# Altium project Clock_Led7_23.PrjPcb
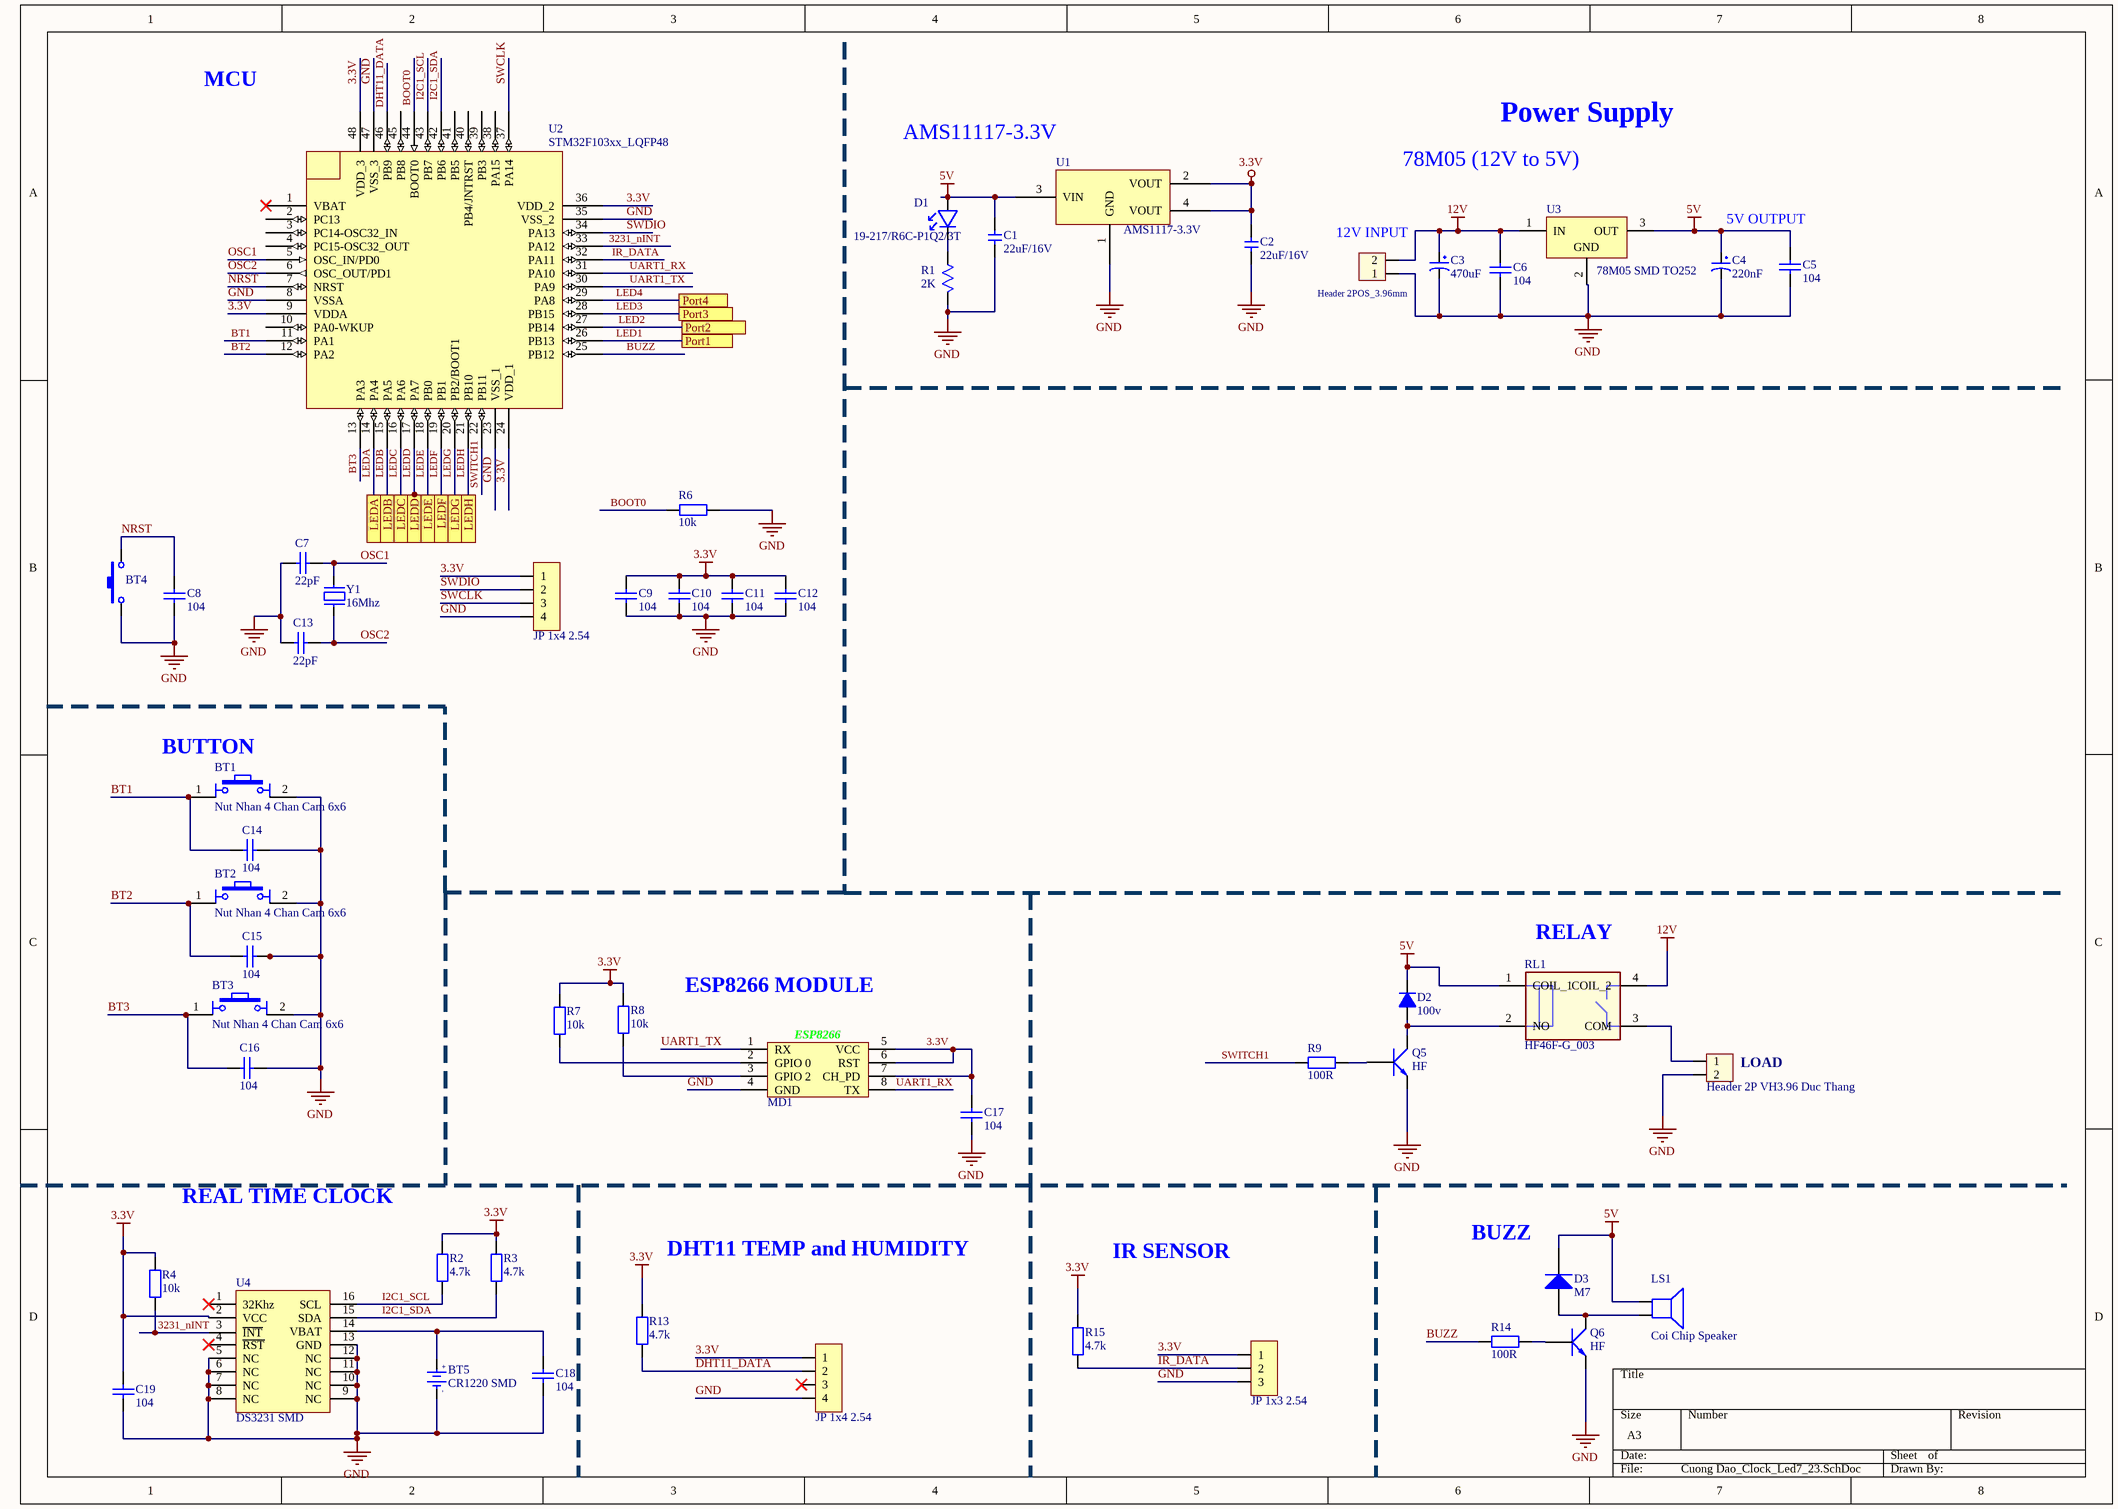
[diagram p0: Cuong Dao_Clock_Led7_23.SchDoc]
2 sheets, 65 parts. Net scope: flat (ports and power ports of the same name join across sheets).
Board file: Clock_Led7_23.PcbDoc
Sheets:
  Cuong Dao_Clock_Led7_23.SchDoc
  LED7seg.SchDoc

## Sheet Cuong Dao_Clock_Led7_23.SchDoc
size A3; SheetNumber: 1; SheetTotal: 2

### Parts
BT1  Nut Nhan 4 Chan Cam 6x6  [Nut Nhan 4 Chan Cam 6x6]
BT2  Nut Nhan 4 Chan Cam 6x6  [Nut Nhan 4 Chan Cam 6x6]
BT3  Nut Nhan 4 Chan Cam 6x6  [Nut Nhan 4 Chan Cam 6x6]
BT4  Nut Nhan 2 Chan SMD 3x6x2.5  [Nut Nhan 2 Chan SMD 3x6x2.5]  (value not drawn)
BT5  CR1220 SMD  [DE PIN CR1220]
C1  22uF/16V  [C0603]
C2  22uF/16V  [C0603]
C3  470uF  [tu hoa 10mm]
C4  220nF  [tu hoa 8mm]
C5  104  [tu 1206]
C6  104  [tu 1206]
C7  22pF  [tu 0805]
C8  104  [tu 0805]
C9  104  [tu 0805]
C10  104  [tu 0805]
C11  104  [tu 0805]
C12  104  [tu 0805]
C13  22pF  [tu 0805]
C14  104  [tu 0805]
C15  104  [tu 0805]
C16  104  [tu 0805]
C17  104  [tu 0805]
C18  104  [tu 0805]
C19  104  [tu 0805]
D1  19-217/R6C-P1Q2/3T  [LED_19-217]
D2  100v  [DIODE 0.5A]
D3  M7  [DIODE SMA]
H1  Header 2POS_3.96mm  [VH3.96M-2]
H2  Header 2P VH3.96 Duc Thang  [VH3.96M-2]
JP1  JP 1x4 2.54  [JP 1x4 DT]
JP2  JP 1x3 2.54  [JP 1x3 CT]
JP3  JP 1x4 2.54  [JP 1x4 CT]
LS1  Coi Chip Speaker  [Coi Chip Speacker]
MD1  ESP8266 Module  [ESP2866 Module]  (value not drawn)
Q5  HF  [SOT23]
Q6  HF  [SOT23]
R1  2K  [RES0603]
R2  4.7k  [tro smd 0805]
R3  4.7k  [tro smd 0805]
R4  10k  [tro smd 0805]
R6  10k  [tro smd 0805]
R7  10k  [tro smd 0805]
R8  10k  [tro smd 0805]
R9  100R  [tro smd 0805]
R13  4.7k  [tro smd 0805]
R14  100R  [tro smd 0805]
R15  4.7k  [tro smd 0805]
RL1  HF46F-G_003  [HF46F012HS1F610]
U1  AMS1117-3.3V  [SOT223]
U2  STM32F103xx_LQFP48  [STM32_LQPF48]
U3  78M05 SMD TO252  [TO252]
U4  DS3231 SMD  [SOIC 16]
Y1  16Mhz  [Thach Anh 2 chan SMD]

### Ports
LEDA, LEDB, LEDC, LEDD, LEDE, LEDF, LEDG, LEDH, Port1, Port2, Port3, Port4

### Nets
3.3V: C2.1 C9.1 C10.1 C11.1 C12.1 C17.2 C19.2 JP1.1 JP2.1 JP3.1 MD1.5(VCC) MD1.6(RST) MD1.7(CH_PD) R2.2 R3.2 R4.2 R7.1 R8.2 R13.2 R15.2 U1.2(VOUT) U1.4(VOUT) U2.9(VDDA) U2.24(VDD_1) U2.36(VDD_2) U2.48(VDD_3) U4.2(VCC)
5V: C1.1 C4.1 C5.1 D1.2(A) D2.2(K) D3.2(K) LS1.1 RL1.1(COIL_1) U1.3(VIN) U3.3(OUT)
12V: C3.1 C6.1 H1.2 RL1.4(COIL_2) U3.1(IN)
GND: BT1.2 BT2.2 BT3.2 BT4.1 BT5.2(GND) C1.2 C2.2 C3.2 C4.2 C5.2 C6.2 C7.2 C8.2 C9.2 C10.2 C11.2 C12.2 C13.1 C14.2 C15.2 C16.2 C17.1 C18.1 C19.1 H1.1 H2.2 JP1.4 JP2.3 JP3.4 MD1.4(GND) Q5.2(E) Q6.2(E) R1.2 R6.1 U1.1(GND) U2.8(VSSA) U2.23(VSS_1) U2.35(VSS_2) U2.47(VSS_3) U3.2(GND) U4.5(NC) U4.6(NC) U4.7(NC) U4.8(NC) U4.9(NC) U4.10(NC) U4.11(NC) U4.12(NC) U4.13(GND)
3231_nINT: R4.1 U2.33(PA12) U4.3(~{INT})
BOOT0: R6.2 U2.44(BOOT0)
BT1: BT1.1 C14.1 U2.11(PA1)
BT2: BT2.1 C15.1 U2.12(PA2)
BT3: BT3.1 C16.1 U2.13(PA3)
BUZZ: R14.1 U2.25(PB12)
DHT11_DATA: JP3.2 R13.1 U2.46(PB9)
I2C1_SCL: R2.1 U2.43(PB7) U4.16(SCL)
I2C1_SDA: R3.1 U2.42(PB6) U4.15(SDA)
IR_DATA: JP2.2 R15.1 U2.32(PA11)
LED1: U2.26(PB13) ; port Port1
LED2: U2.27(PB14) ; port Port2
LED3: U2.28(PB15) ; port Port3
LED4: U2.29(PA8) ; port Port4
LEDA: U2.14(PA4) ; port LEDA
LEDB: U2.15(PA5) ; port LEDB
LEDC: U2.16(PA6) ; port LEDC
LEDD: U2.17(PA7) ; port LEDD
LEDE: U2.18(PB0) ; port LEDE
LEDF: U2.19(PB1) ; port LEDF
LEDG: U2.20(PB2/BOOT1) ; port LEDG
LEDH: U2.21(PB10) ; port LEDH
NRST: BT4.2 C8.1 U2.7(NRST)
OSC1: C7.1 U2.5(OSC_IN/PD0) Y1.2
OSC2: C13.2 U2.6(OSC_OUT/PD1) Y1.1
SWCLK: JP1.3 U2.37(PA14)
SWDIO: JP1.2 U2.34(PA13)
SWITCH1: R9.1 U2.22(PB11)
UART1_RX: MD1.8(TX) U2.31(PA10)
UART1_TX: MD1.1(RX) U2.30(PA9)
NetBT5_1: BT5.1(+3V) C18.2 U4.14(VBAT)
NetD1_1: D1.1(K) R1.1
NetD2_1: D2.1(A) Q5.3(C) RL1.2(NO)
NetD3_1: D3.1(A) LS1.2 Q6.3(C)
NetH2_1: H2.1 RL1.3(COM)
NetMD1_2: MD1.2(GPIO_0) R7.2
NetMD1_3: MD1.3(GPIO_2) R8.1
NetQ5_1: Q5.1(B) R9.2
NetQ6_1: Q6.1(B) R14.2

Not connected (* = marked no-connect by the designer): JP3 3*; U2 1(VBAT)* 2(PC13) 3(PC14-OSC32_IN) 4(PC15-OSC32_OUT) 10(PA0-WKUP) 38(PA15) 39(PB3) 40(PB4/JNTRST) 41(PB5) 45(PB8); U4 1(32Khz)* 4(~{RST})*

### Notes on the sheet
- MCU
- (near U1) AMS11117-3.3V
- 78M05 (12V to 5V)
- Power Supply
- (near H1) 12V INPUT
- 5V OUTPUT
- (near BT1) BUTTON
- (near RL1) RELAY
- ESP8266 MODULE
- (near H2) LOAD
- REAL TIME CLOCK
- DHT11 TEMP and HUMIDITY
- IR SENSOR
- (near D3) BUZZ
- (in symbol De pin CR1220 SMD) +; -
- (in symbol ESP8266 Module) ESP8266

### Library data of the parts
BT1-BT3 = Nut Nhan 4 Chan Cam 6x6: Nut Nhan 4 Chan 6x6mm; Ten: Nút Nhấn 4 Chân 6x6x5MM DIP; Ma_Hang: MH004584
BT4 = Nut Nhan 2 Chan SMD 3x6x2.5: Ma_Hang: MH001036; Ten: Nút Nhấn 2 Chân 3x6x2.5MM SMD
BT5 = De pin CR1220 SMD: Ten: Đế PIN CR1220 SMD; Ma_Hang: MH000833
C1 C2 = C0603: Multilayer Ceramic Capacitors MLCC, SMD/SMT 22uF, 16V, 10%, 0603; Part Number: *; MFR: *
C3 = Tu Hoa 470uF 35V 10x15: Cắm; Don_Vi: Con; So_Chan: 2; Ten_Linh_Kien: Tụ Hóa 470uF 35V 10x15MM; Ma_Hang: MH002204; Chung_Loai: Cắm; Kieu_Chan: *
C4 = Tu Hoa 220uF 35V 8x12: Cắm; Don_Vi: Con; So_Chan: 2; Ten_Linh_Kien: Tụ Hóa 220uF 35V 8x12MM; Ma_Hang: MH006553; Chung_Loai: Cắm; Kieu_Chan: *
C5 C6 = Tu 1206 104 50V 20%: Dán; Don_Vi: Con; So_Chan: 2; Ten_Linh_Kien: Tụ 1206 104-0.1uF 20% 50V; Ma_Hang: MH004544; Chung_Loai: Dán; Kieu_Chan: *
C7 C13 = Tu 0805 22pF 50V 10%: Dán; Don_Vi: Con; So_Chan: 2; Ten_Linh_Kien: Tụ 0805 22P 10% 50V; Ma_Hang: MH004560; Chung_Loai: Dán; Kieu_Chan: *
C8-C12 C14-C19 = Tu 0805 104 50V 10%: Dán; Don_Vi: Con; So_Chan: 2; Ten_Linh_Kien: Tụ 0805 104-100nF 10% 50V; Ma_Hang: MH004551; Chung_Loai: Dán; Kieu_Chan: *
D1 = LED 19-217: LED; Height: 0.9mm; Part Number: 19-217/R6C-P1Q2/
D2 = Diode 1N4148: Cắm; Ten_Linh_Kien: Diode 1N4148 DO35 450mA 100V ( 1N4148 DIP); Don_Vi: Con; Ma_Hang: MH001065; Ghi Chu: *; Kieu_Chan: *; Chung_Loai: Cắm
D3 = Diode M7 ( 4007 ): Dán; Don_Vi: Con; Ten_Linh_Kien: Diode M7 1N4007 SMD 1A 1000V; Ma_Hang: MH000944; Chung_Loai: Dán; Ghi_Chu: *
H1 H2 = Header 2P VH3.96 Duc Thang: Cắm; Ten_Linh_Kien: Header 2P XH2.54-2P Đực Thẳng; Don_Vi: Con; Ma_Hang: MH001283; Chung_Loai: Cắm
JP1 = JP 1x4 2.54 Duc Thang: Cắm; Ten_Linh_Kien: Jump Đơn Đực 2.54MM 1x40P Thẳng 11MM; Don_Vi: Con; Ma_Hang: MH000903; Ghi_Chu: *; Kieu_Chan: *; Chung_Loai: Cắm
JP2 = JP 1x3 2.54 Cai Thang: Cắm; Ten_Linh_Kien: Jump Đơn Cái 2.54MM 1x20P Thẳng; Don_Vi: Con; Ma_Hang: MH004006; Ghi_Chu: *; Kieu_Chan: *; Chung_Loai: Cắm
JP3 = JP 1x4 2.54 Cai Thang: Cắm; Ten_Linh_Kien: Jump Đơn Cái 2.54MM 1x20P Thẳng; Don_Vi: Con; Ma_Hang: MH004006; Ghi_Chu: *; Kieu_Chan: *; Chung_Loai: Cắm
LS1 = Coi Chip Speaker: Còi chip
Q5 Q6 = C1815 HF SMD: NPN transistor; Value: C9014
R1 = R0603: Chip Resistor - Surface Mount 2KΩ ±1% 1/16W 0603 RoHS; Part Number: *; MFR: *
R2 R3 R13 R15 = Tro 0805 5% 4.7k: Dán; Don_Vi: Con; So_Chan: 2; Ten_Linh_Kien: Trở 0805 5% 4.7k; Ma_Hang: MH005307; Chung_Loai: Dán; Kieu_Chan: *
R4 R6-R8 = Tro 0805 5% 10k: Dán; Don_Vi: Con; So_Chan: 2; Ten_Linh_Kien: Trở 0805 5% 10k; Ma_Hang: MH005239; Chung_Loai: Dán; Kieu_Chan: *
R9 R14 = Tro 0805 5% 100R: Dán; Don_Vi: Con; So_Chan: 2; Ten_Linh_Kien: Trở 0805 5% 100R; Ma_Hang: MH005251; Chung_Loai: Dán; Kieu_Chan: *
RL1 = Relay_HF46F: HF46F-G_003-HS1F_610_; MFR: Hongfa; Part Number: HF46F-G/003-HS1F(610); Datasheet Link: https://docs.rs-online.com/fb0b/0900766b81663fd2.pdf; Height: 15.3mm
U1 = AMS1117 SMD: SMD LDO regulator; MFR: Advanced Monolithic System; Value: AMS1117-3.3V SOT223; Ma_Hang: MH000596; Chung_Loai: Dán; Part Number: AMS1117-3.3V
U3 = 78M05 SMD TO252: Dán; Don_Vi: Con; Ten_Linh_Kien: 78M05 TO252; Ma_Hang: MH001917; Ghi_Chu: *; Kieu_Chan: *; Chung_Loai: Dán
U4 = DS3231 SMD: SOIC
Y1 = Thach Anh 2 chan SMD: Crystal For all Crystal 2pin.; Value: 4Mhz
U2 = STM32F103xx_LQFP48: Published: 30-May-2008; DatasheetVersion: rev6, Mar-2008; PackageVersion: Mar-2008; PackageReference: LQFP48; Publisher: Altium Limited; PackageDescription: 48-Pin Low-Profile Quad Flat Pack, 7 x 7 mm Body, 0.5 mm Pitch (LQFP48); ComponentLink1Description: Manufacturer Link; ComponentLink1URL: www.st.com/stm32; ComponentLink2Description: Datasheet; ComponentLink2URL: http://www.st.com/stonline/products/literature/ds/13587.pdf

## Sheet LED7seg.SchDoc
size A; SheetNumber: 2; SheetTotal: 2
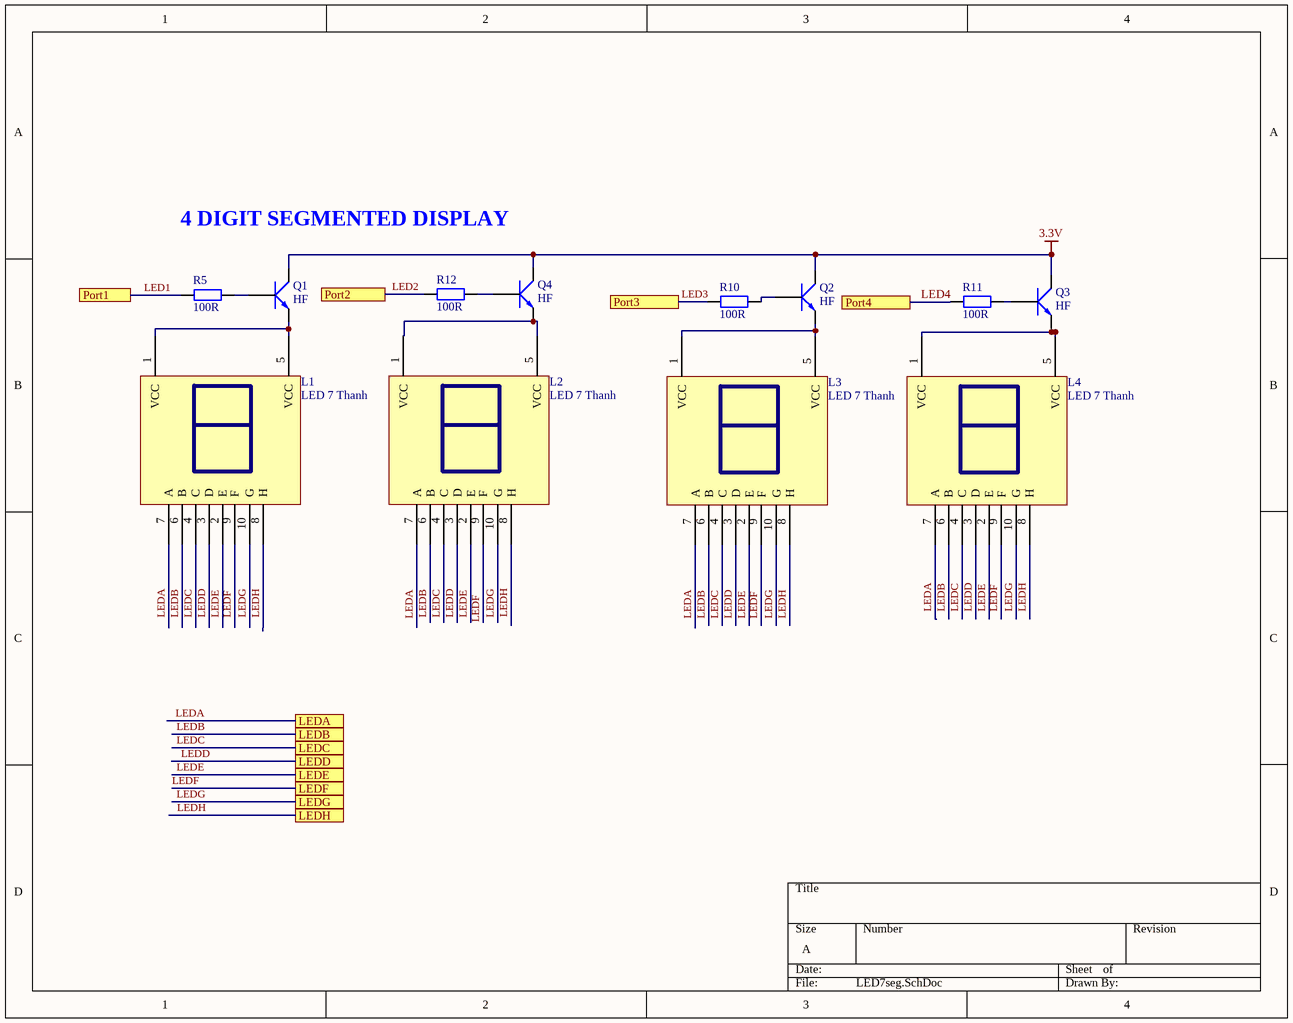
[diagram p1: LED7seg.SchDoc]

### Parts
L1  LED 7 Thanh  [LED7SEG_2.3inch]
L2  LED 7 Thanh  [LED7SEG_2.3inch]
L3  LED 7 Thanh  [LED7SEG_2.3inch]
L4  LED 7 Thanh  [LED7SEG_2.3inch]
Q1  HF  [SOT23]
Q2  HF  [SOT23]
Q3  HF  [SOT23]
Q4  HF  [SOT23]
R5  100R  [tro smd 0805]
R10  100R  [tro smd 0805]
R11  100R  [tro smd 0805]
R12  100R  [tro smd 0805]

### Ports
LEDA, LEDB, LEDC, LEDD, LEDE, LEDF, LEDG, LEDH, Port1, Port2, Port3, Port4

### Nets
3.3V: Q1.3(C) Q2.3(C) Q3.3(C) Q4.3(C)
LED1: R5.1 ; port Port1
LED2: R12.1 ; port Port2
LED3: R10.1 ; port Port3
LED4: R11.1 ; port Port4
LEDA: L1.7(A) L2.7(A) L3.7(A) L4.7(A) ; port LEDA
LEDB: L1.6(B) L2.6(B) L3.6(B) L4.6(B) ; port LEDB
LEDC: L1.4(C) L2.4(C) L3.4(C) L4.4(C) ; port LEDC
LEDD: L1.3(D) L2.3(D) L3.3(D) L4.3(D) ; port LEDD
LEDE: L1.2(E) L2.2(E) L3.2(E) L4.2(E) ; port LEDE
LEDF: L1.9(F) L2.9(F) L3.9(F) L4.9(F) ; port LEDF
LEDG: L1.10(G) L2.10(G) L3.10(G) L4.10(G) ; port LEDG
LEDH: L1.8(H) L2.8(H) L3.8(H) L4.8(H) ; port LEDH
NetL1_1: L1.1(VCC) L1.5(VCC) Q1.2(E)
NetL2_1: L2.1(VCC) L2.5(VCC) Q4.2(E)
NetL3_1: L3.1(VCC) L3.5(VCC) Q2.2(E)
NetL4_1: L4.1(VCC) L4.5(VCC) Q3.2(E)
NetQ1_1: Q1.1(B) R5.2
NetQ2_1: Q2.1(B) R10.2
NetQ3_1: Q3.1(B) R11.2
NetQ4_1: Q4.1(B) R12.2

### Notes on the sheet
- 4 DIGIT SEGMENTED DISPLAY

### Library data of the parts
L1-L4 = LED 7x1 2.3inch Anot: Dán; Don_Vi: Con; Ma_Hang: MH000901; Ten_Linh_Kien: Led 7 2.3 1 Số Anot (Sáng Đỏ); Ghi_Chu: *; Kieu_Chan: *; Chung_Loai: Dán
Q1-Q4 = C1815 HF SMD: NPN transistor; Value: C9014
R5 R10-R12 = Tro 0805 5% 100R: as R9 on sheet Cuong Dao_Clock_Led7_23; Chung_Loai: Dán; Kieu_Chan: *

## Nets that join several sheets
3.3V: Cuong Dao_Clock_Led7_23 (27 pins), LED7seg (Q1.3 Q2.3 Q3.3 Q4.3)
LED1: Cuong Dao_Clock_Led7_23 (U2.26), LED7seg (R5.1)
LED2: Cuong Dao_Clock_Led7_23 (U2.27), LED7seg (R12.1)
LED3: Cuong Dao_Clock_Led7_23 (U2.28), LED7seg (R10.1)
LED4: Cuong Dao_Clock_Led7_23 (U2.29), LED7seg (R11.1)
LEDA: Cuong Dao_Clock_Led7_23 (U2.14), LED7seg (L1.7 L2.7 L3.7 L4.7)
LEDB: Cuong Dao_Clock_Led7_23 (U2.15), LED7seg (L1.6 L2.6 L3.6 L4.6)
LEDC: Cuong Dao_Clock_Led7_23 (U2.16), LED7seg (L1.4 L2.4 L3.4 L4.4)
LEDD: Cuong Dao_Clock_Led7_23 (U2.17), LED7seg (L1.3 L2.3 L3.3 L4.3)
LEDE: Cuong Dao_Clock_Led7_23 (U2.18), LED7seg (L1.2 L2.2 L3.2 L4.2)
LEDF: Cuong Dao_Clock_Led7_23 (U2.19), LED7seg (L1.9 L2.9 L3.9 L4.9)
LEDG: Cuong Dao_Clock_Led7_23 (U2.20), LED7seg (L1.10 L2.10 L3.10 L4.10)
LEDH: Cuong Dao_Clock_Led7_23 (U2.21), LED7seg (L1.8 L2.8 L3.8 L4.8)